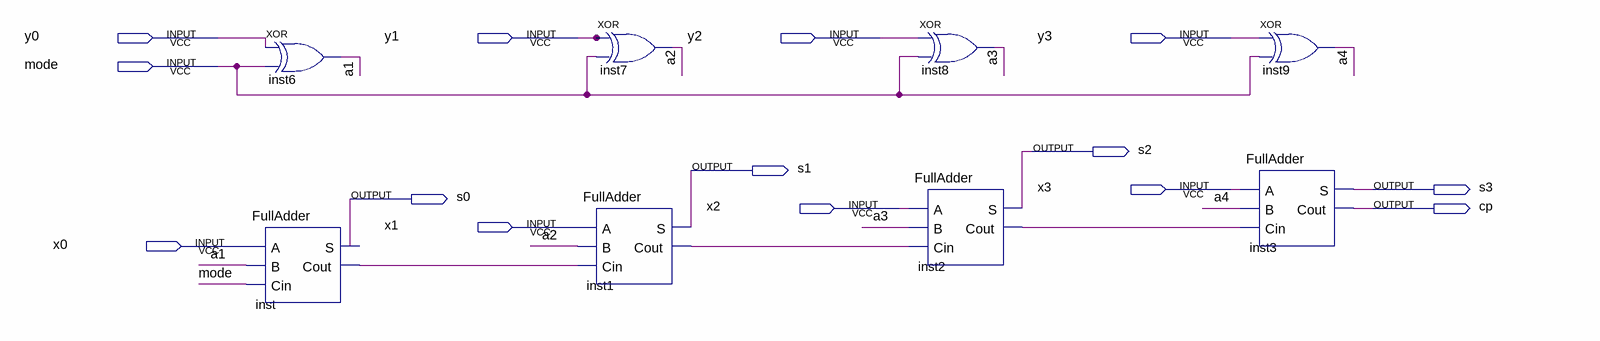
[diagram p0: schematic sheet]
// Quartus schematic Lab4b.bdf as structural Verilog: 8 symbols, 14 pins
module Lab4b (
  input  y0,
  input  y1,
  input  y2,
  input  y3,
  input  mode,
  input  x3,
  input  x2,
  input  x1,
  input  x0,
  output s2,
  output s1,
  output s3,
  output s0,
  output cp
);

  wire a1, a2, a3, a4, inst1_cout, inst2_cout, inst_cout;

  FullAdder inst (.A(x0), .B(a1), .Cin(mode), .S(s0), .Cout(inst_cout));
  xor inst6 (a1, y0, mode);
  xor inst7 (a2, y1, mode);
  FullAdder inst1 (.A(x1), .B(a2), .Cin(inst_cout), .S(s1), .Cout(inst1_cout));
  xor inst8 (a3, y2, mode);
  FullAdder inst2 (.A(x2), .B(a3), .Cin(inst1_cout), .S(s2), .Cout(inst2_cout));
  xor inst9 (a4, y3, mode);
  FullAdder inst3 (.A(x3), .B(a4), .Cin(inst2_cout), .S(s3), .Cout(cp));
endmodule
